# EAGLE board secs_q84 v2 (EAGLE 9.6.2), part 1 of 2
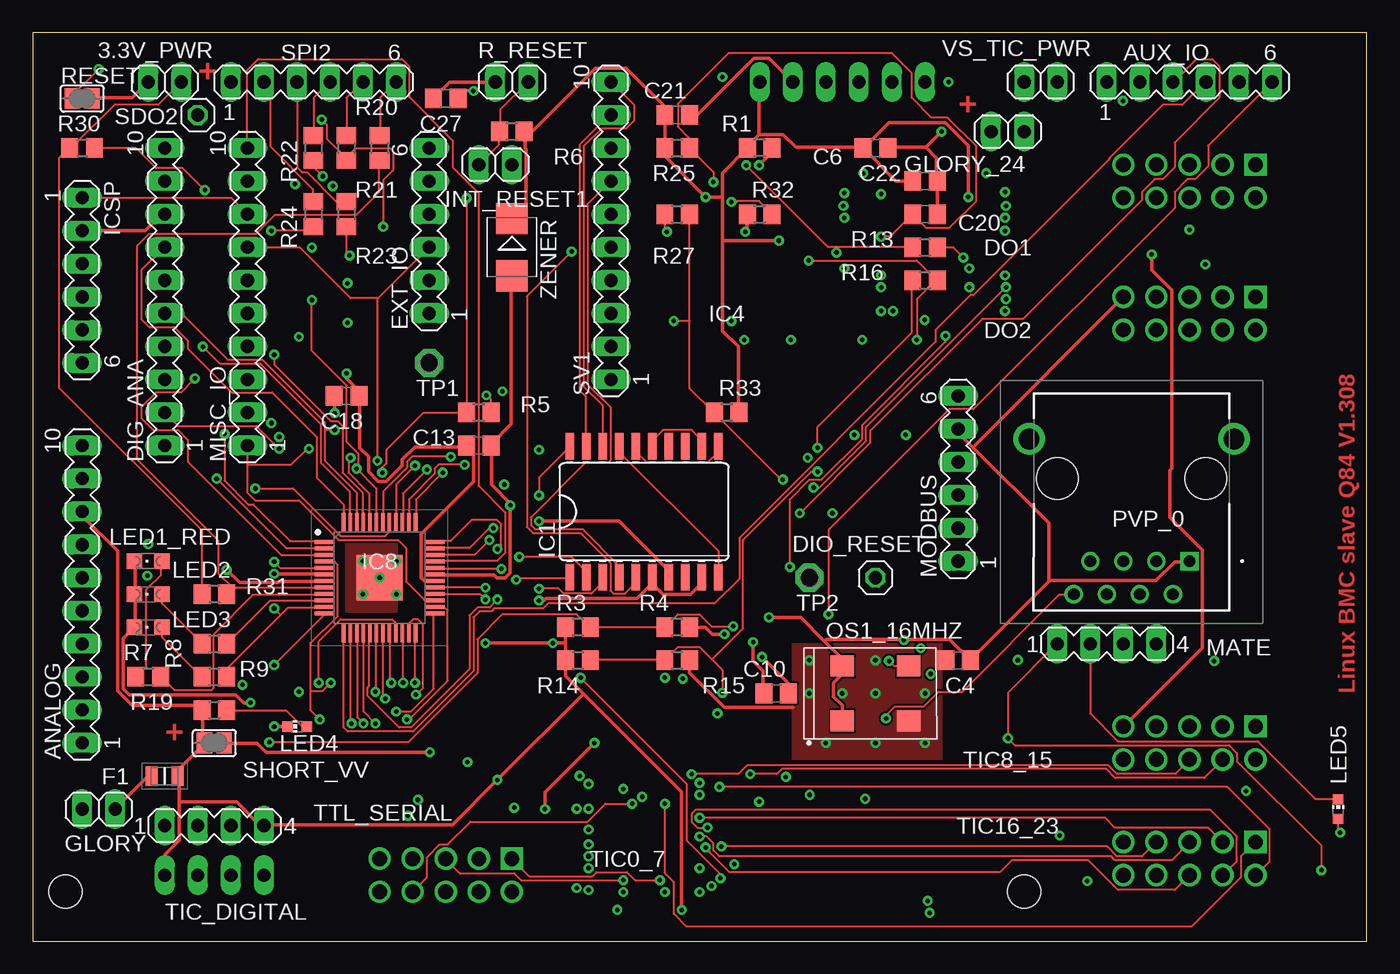
[diagram p2: board, top side]
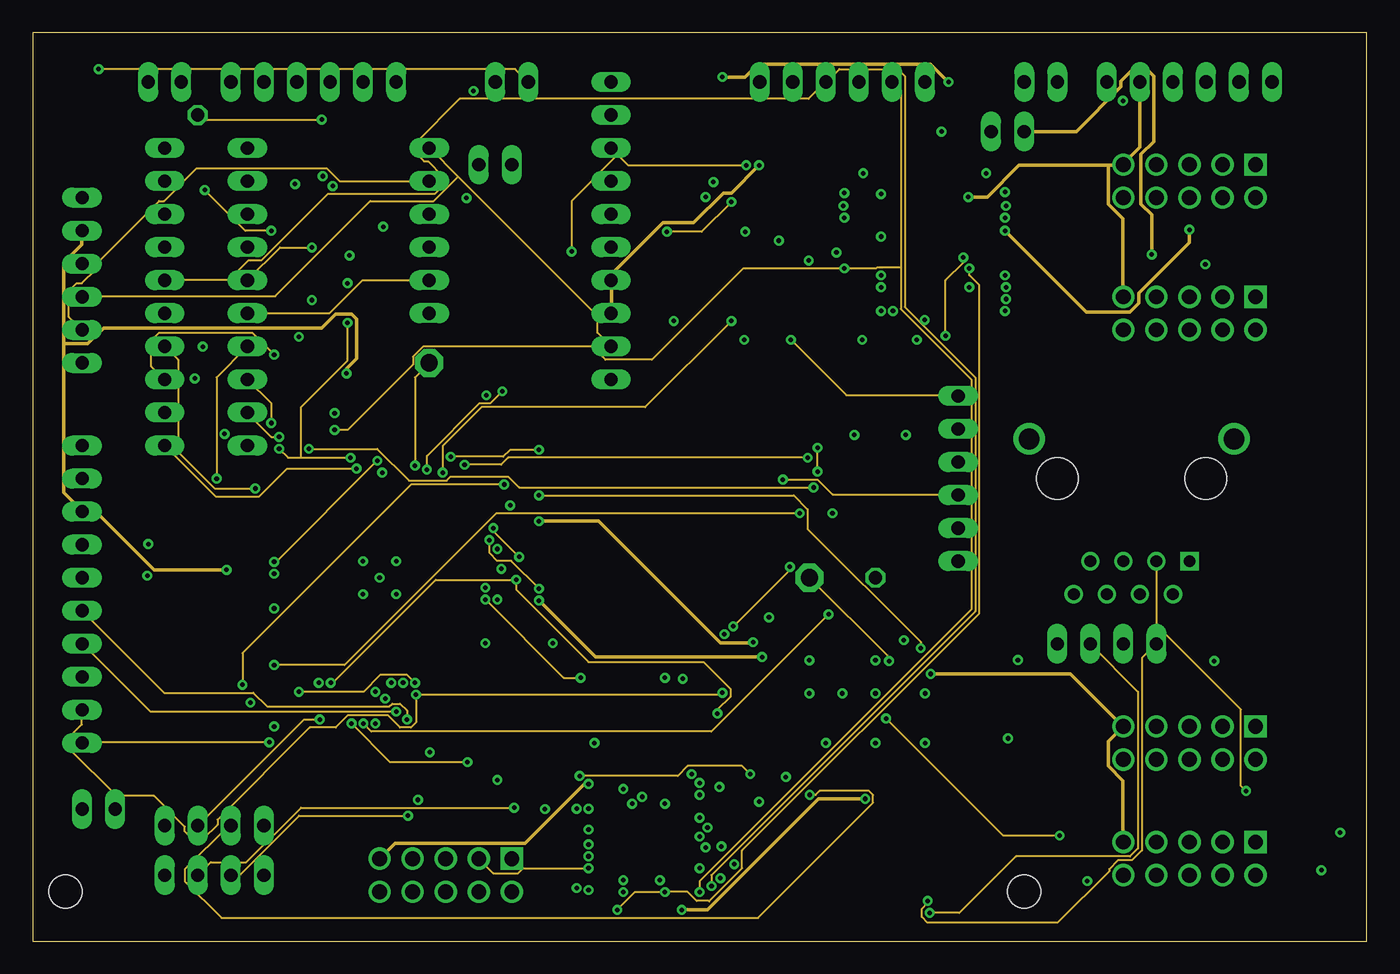
[diagram p3: board, inner layer Route2]
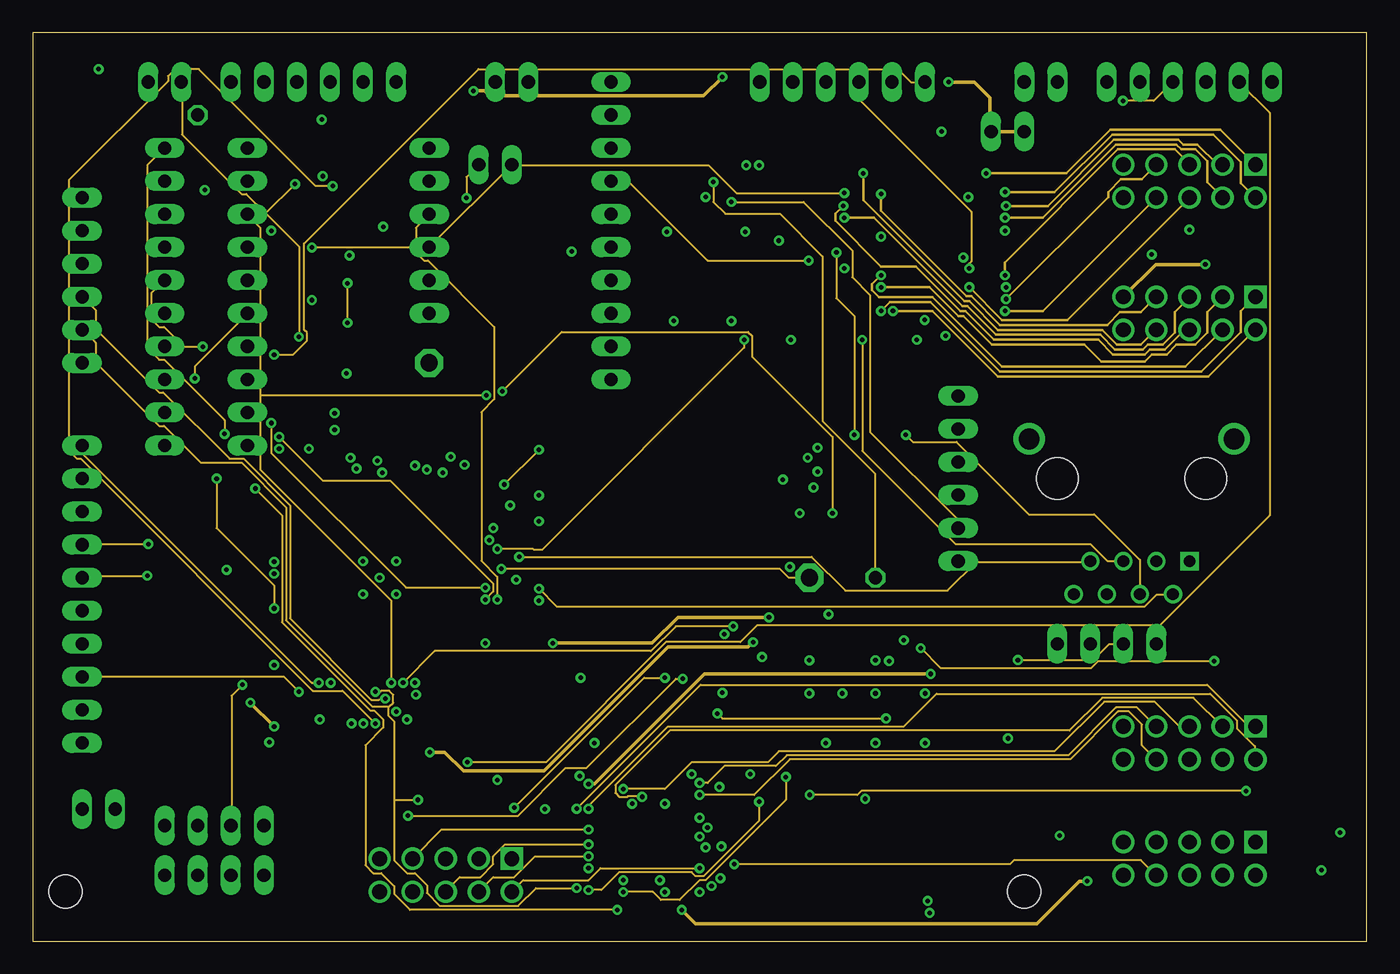
[diagram p4: board, inner layer Route15]
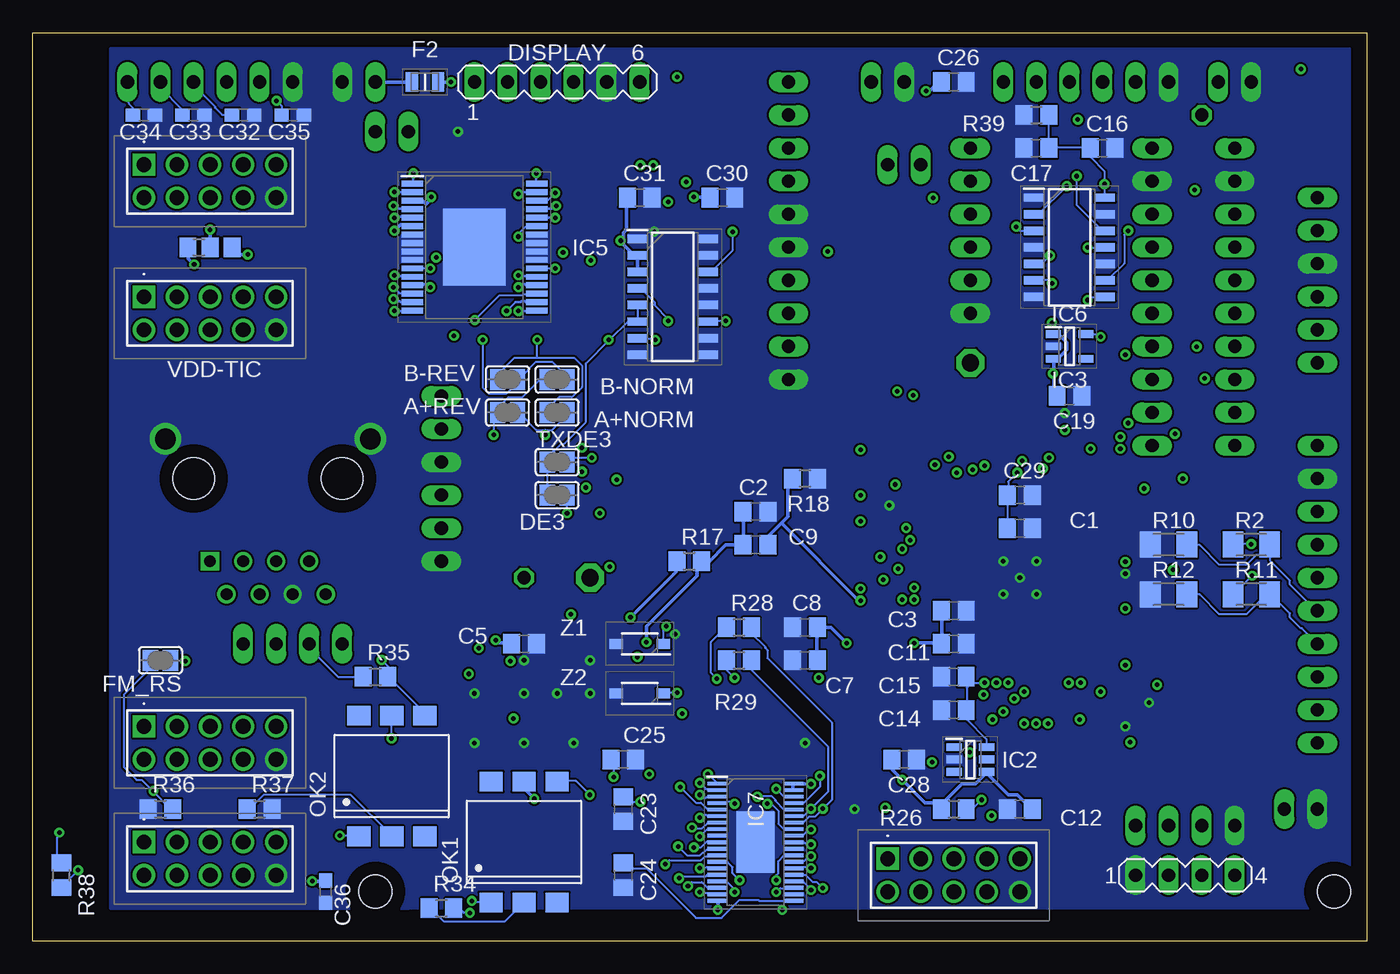
[diagram p5: board, bottom side, seen from below]

Size 102.54 x 69.84 mm. Coordinates in mm from the lower left corner, seen from the top.
Outline: 0,0 102.54,0 102.54,69.84 0,69.84 0,0
Copper layers (1+2*15+16): Top 0.035mm / dielectric 1.5mm / Route2 0.035mm / dielectric 0.15mm / Route15 0.035mm / dielectric 0.2mm / Bottom 0.035mm
Design rules "default *": minimum track width 6mil, minimum drill 0.35mm, track to track 6mil, track to pad 6mil, pad to pad 6mil, via to via 6mil, smd to smd 6mil, copper to edge 40mil, drill to drill 6mil, minimum pad ring 10mil, minimum via ring 8mil, stop-mask expansion 4mil, vias tented up to drill 0mil, thermal gap 10mil
Net classes: 1 icurrent: width 0.254 mm; 2 ocurrent: width 0.203 mm
Holes 2.54 mm at 2.54,3.81 76.2,3.81
vRestrict: area 19.1,20.3 to 34.3,35.6; area 52.1,39.4 to 76.2,45.7; area 39.4,25.4 to 57.1,40.6

## Footprints (pad centres in the part's own frame; a part is rotated, then mirrored left to right if it is on the bottom)
1X02 = drill 1.016 long: 1 -1.27,0; 2 1.27,0
SJ = smd 1.168 x 1.6: 1 -0.762,0; 2 0.762,0
MA10-1 = drill 1.016 long: 1 -11.43,0; 2 -8.89,0; 3 -6.35,0; 4 -3.81,0; 5 -1.27,0; 6 1.27,0; 7 3.81,0; 8 6.35,0; 9 8.89,0; 10 11.43,0
MA06-1 = drill 1.016 long: 1 -6.35,0; 2 -3.81,0; 3 -1.27,0; 4 1.27,0; 5 3.81,0; 6 6.35,0
C0805 = smd 1.3 x 1.5: 1 -0.95,0; 2 0.95,0
C0603 = smd 1.1 x 1: 1 -0.85,0; 2 0.85,0
1X01 = drill 1.016 octagon: 1 0,0
879141016 = drill 1.14 pad 1.71 square: 1 0,0 | drill 1.14 pad 1.71: 2 0,-2.54; 3 2.54,0; 4 2.54,-2.54; 5 5.08,0; 6 5.08,-2.54; 7 7.62,0; 8 7.62,-2.54; 9 10.16,0; 10 10.16,-2.54
FUSC2114X125N = smd 0.93 x 1.52: 1 -1,0; 2 1,0
SO20L = smd 0.66 x 2.032: 1 -5.715,-5.029; 2 -4.445,-5.029; 3 -3.175,-5.029; 4 -1.905,-5.029; 5 -0.635,-5.029; 6 0.635,-5.029; 7 1.905,-5.029; 8 3.175,-5.029; 9 4.445,-5.029; 10 5.715,-5.029; 11 5.715,5.029; 12 4.445,5.029; 13 3.175,5.029; 14 1.905,5.029; 15 0.635,5.029; 16 -0.635,5.029; 17 -1.905,5.029; 18 -3.175,5.029; 19 -4.445,5.029; 20 -5.715,5.029
SOT95P280X145-6N = smd 1.2 x 0.6: 1 -1.25,0.95; 2 -1.25,0; 3 -1.25,-0.95; 4 1.25,-0.95; 5 1.25,0; 6 1.25,0.95
SOT95P280X100-5N = smd 1.15 x 0.6: 1 -1.25,0.95; 2 -1.25,0; 3 -1.25,-0.95; 4 1.25,-0.95; 5 1.25,0.95
SOIC127P600X175-16N = smd 1.525 x 0.65: 1 -2.712,4.445; 2 -2.712,3.175; 3 -2.712,1.905; 4 -2.712,0.635; 5 -2.712,-0.635; 6 -2.712,-1.905; 7 -2.712,-3.175; 8 -2.712,-4.445; 9 2.712,-4.445; 10 2.712,-3.175; 11 2.712,-1.905; 12 2.712,-0.635; 13 2.712,0.635; 14 2.712,1.905; 15 2.712,3.175; 16 2.712,4.445
SOP65P1030X265-33N = smd 1.65 x 0.45: 1 -4.775,4.875; 2 -4.775,4.225; 3 -4.775,3.575; 4 -4.775,2.925; 5 -4.775,2.275; 6 -4.775,1.625; 7 -4.775,0.975; 8 -4.775,0.325; 9 -4.775,-0.325; 10 -4.775,-0.975; 11 -4.775,-1.625; 12 -4.775,-2.275; 13 -4.775,-2.925; 14 -4.775,-3.575; 15 -4.775,-4.225; 16 -4.775,-4.875; 17 4.775,-4.875; 18 4.775,-4.225; 19 4.775,-3.575; 20 4.775,-2.925; 21 4.775,-2.275; 22 4.775,-1.625; 23 4.775,-0.975; 24 4.775,-0.325; 25 4.775,0.325; 26 4.775,0.975; 27 4.775,1.625; 28 4.775,2.275; 29 4.775,2.925; 30 4.775,3.575; 31 4.775,4.225; 32 4.775,4.875 | smd 4.8 x 5.9: 33 0,0
SOIC127P600X175-14N = smd 1.55 x 0.65: 1 -2.725,3.81; 2 -2.725,2.54; 3 -2.725,1.27; 4 -2.725,0; 5 -2.725,-1.27; 6 -2.725,-2.54; 7 -2.725,-3.81; 8 2.725,-3.81; 9 2.725,-2.54; 10 2.725,-1.27; 11 2.725,0; 12 2.725,1.27; 13 2.725,2.54; 14 2.725,3.81
SOP50P640X120-39N = smd 1.475 x 0.3: 1 -2.938,4.5; 2 -2.938,4; 3 -2.938,3.5; 4 -2.938,3; 5 -2.938,2.5; 6 -2.938,2; 7 -2.938,1.5; 8 -2.938,1; 9 -2.938,0.5; 10 -2.938,0; 11 -2.938,-0.5; 12 -2.938,-1; 13 -2.938,-1.5; 14 -2.938,-2; 15 -2.938,-2.5; 16 -2.938,-3; 17 -2.938,-3.5; 18 -2.938,-4; 19 -2.938,-4.5; 20 2.938,-4.5; 21 2.938,-4; 22 2.938,-3.5; 23 2.938,-3; 24 2.938,-2.5; 25 2.938,-2; 26 2.938,-1.5; 27 2.938,-1; 28 2.938,-0.5; 29 2.938,0; 30 2.938,0.5; 31 2.938,1; 32 2.938,1.5; 33 2.938,2; 34 2.938,2.5; 35 2.938,3; 36 2.938,3.5; 37 2.938,4; 38 2.938,4.5 | smd 2.9 x 4.7: 39 0,0
QFP50P900X900X120-49N = smd 1.475 x 0.3: 1 -4.238,2.75; 2 -4.238,2.25; 3 -4.238,1.75; 4 -4.238,1.25; 5 -4.238,0.75; 6 -4.238,0.25; 7 -4.238,-0.25; 8 -4.238,-0.75; 9 -4.238,-1.25; 10 -4.238,-1.75; 11 -4.238,-2.25; 12 -4.238,-2.75; 25 4.238,-2.75; 26 4.238,-2.25; 27 4.238,-1.75; 28 4.238,-1.25; 29 4.238,-0.75; 30 4.238,-0.25; 31 4.238,0.25; 32 4.238,0.75; 33 4.238,1.25; 34 4.238,1.75; 35 4.238,2.25; 36 4.238,2.75 | smd 0.3 x 1.475: 13 -2.75,-4.238; 14 -2.25,-4.238; 15 -1.75,-4.238; 16 -1.25,-4.238; 17 -0.75,-4.238; 18 -0.25,-4.238; 19 0.25,-4.238; 20 0.75,-4.238; 21 1.25,-4.238; 22 1.75,-4.238; 23 2.25,-4.238; 24 2.75,-4.238; 37 2.75,4.238; 38 2.25,4.238; 39 1.75,4.238; 40 1.25,4.238; 41 0.75,4.238; 42 0.25,4.238; 43 -0.25,4.238; 44 -0.75,4.238; 45 -1.25,4.238; 46 -1.75,4.238; 47 -2.25,4.238; 48 -2.75,4.238 | smd 3.5 x 3.5: 49 0,0
CHIPLED_0805 = smd 1.2 x 1.2: A 0,-1.05; C 0,1.05
CHIP-LED0603 = smd 0.8 x 0.8: A 0,-0.75; C 0,0.75
MA04-1 = drill 1.016 long: 1 -3.81,0; 2 -1.27,0; 3 1.27,0; 4 3.81,0
DIL6-SMD = smd 1.78 x 1.52: 1 -2.54,-4.645; 2 0,-4.645; 3 2.54,-4.645; 4 2.54,4.645; 5 0,4.645; 6 -2.54,4.645
7.2X5.2-4-PAD = smd 1.8 x 1.6: 1 -2.54,-2.1; 2 2.54,-2.1; 3 2.54,2.1; 4 -2.54,2.1
317345774 = drill 0.9 pad 1.4 square: 1 0,0 | drill 0.9 pad 1.4: 2 -1.27,-2.54; 3 -2.54,0; 4 -3.81,-2.54; 5 -5.08,0; 6 -6.35,-2.54; 7 -7.62,0; 8 -8.89,-2.54 | drill 1.6 pad 2.4: 9 3.43,9.4; 10 -12.32,9.4 | hole 3.2: 1.27,6.35; -10.16,6.35
R0805 = smd 1.3 x 1.5: 1 -0.95,0; 2 0.95,0
M1206 = smd 1.6 x 2: 1 -1.4,0; 2 1.4,0
P1-13 = drill 1.321 pad 2.159 octagon: TP 0,0
A0R-JMP = smd 1.5 x 1.3: 1 0,1.7; 2 0,0; 3 0,-1.7
SOD3716X135N = smd 1.05 x 0.75: 1 -1.8,0; 2 1.8,0
SMB = smd 2.4 x 2.4: A 2.2,0; C -2.2,0

## Placement (x,y rotation side)
3.3V_PWR  3.3V_PWR  [1X02]  10.16,66.04 0 top
A+NORM  A+NORM  [SJ]  62.23,40.64 0 bottom
A+REV  A+REV  [SJ]  66.04,40.64 0 bottom
ANALOG  Analog  [MA10-1]  3.81,26.67 90 top
AUX_IO  AUX_IO  [MA06-1]  88.9,66.04 0 top
B-NORM  B-NORM  [SJ]  62.23,43.18 0 bottom
B-REV  B-REV  [SJ]  66.04,43.18 0 bottom
C1  0.1uf  [C0805]  26.67,31.75 0 bottom
C2  0.1uf  [C0805]  46.99,33.02 0 bottom
C3  0.1uf  [C0805]  31.75,25.4 0 bottom
C4  10uf  [C0805]  71.12,21.59 180 top
C5  0.1uf  [C0805]  64.77,22.86 0 bottom
C6  10uf  [C0805]  64.77,60.96 0 top
C7  0.1uf  [C0805]  43.18,21.59 180 bottom
C8  10uf  [C0805]  43.18,24.13 180 bottom
C9  0.1uf  [C0805]  46.99,30.48 0 bottom
C10  10uf  [C0805]  57.15,19.05 0 top
C11  0.1uf  [C0805]  31.75,22.86 0 bottom
C12  0.1uf  [C0805]  26.67,10.16 180 bottom
C13  10uf  [C0805]  34.29,38.1 0 top
C14  0.1uf  [C0805]  31.75,17.78 180 bottom
C15  10uf  [C0805]  31.75,20.32 180 bottom
C16  0.1uf  [C0805]  20.32,60.96 0 bottom
C17  10uf  [C0805]  25.4,60.96 180 bottom
C18  10uf  [C0805]  24.13,41.91 180 top
C19  0.1uf  [C0805]  22.86,41.91 0 bottom
C20  0.1uf  [C0805]  68.58,55.88 0 top
C21  0.1uf  [C0805]  49.53,63.5 0 top
C22  10uf  [C0805]  68.58,58.42 0 top
C23  0.1uf  [C0805]  57.15,10.16 270 bottom
C24  0.1uf  [C0805]  57.15,5.08 270 bottom
C25  1uf  [C0805]  57.15,13.97 0 bottom
C26  0.1uf  [C0805]  31.75,66.04 0 bottom
C27  10uf  [C0805]  31.75,64.77 180 top
C28  0.1uf  [C0805]  35.56,13.97 0 bottom
C29  10uf  [C0805]  26.67,34.29 0 bottom
C30  10uf  [C0805]  49.53,57.15 0 bottom
C31  0.1uf  [C0805]  55.88,57.15 0 bottom
C32  0.1uf  [C0603]  86.36,63.5 0 bottom
C33  0.1uf  [C0603]  90.17,63.5 0 bottom
C34  0.1uf  [C0603]  93.98,63.5 0 bottom
C35  0.1uf  [C0603]  82.55,63.5 0 bottom
C36  0.1uf  [C0603]  80.01,3.81 270 bottom
DE3  DE3  [SJ]  62.23,34.29 0 bottom
DIG_ANA  Digtal/Analog  [MA10-1]  10.16,49.53 90 top
DIO_RESET  dio reset  [1X01]  64.77,27.94 0 top
DISPLAY  DISPLAY  [MA06-1]  62.23,66.04 0 bottom
DO1  87914-1016  [879141016]  93.98,59.69 0 bottom
DO2  87914-1016  [879141016]  93.98,49.53 0 bottom
EXT_IO  EXT_IO  [MA06-1]  30.48,54.61 90 top
F1  0805L075WR  [FUSC2114X125N]  10.16,12.7 0 top
F2  0805L075WR  [FUSC2114X125N]  72.39,66.04 0 bottom
FM_RS  FM_RS  [SJ]  92.71,21.59 180 bottom
GLORY  GLORY  [1X02]  5.08,10.16 0 top
GLORY_24  GLORY_24  [1X02]  74.93,62.23 0 top
IC1  MAX203ECWP  [SO20L]  46.99,33.02 0 top
IC2  REF3440TIDBVR  [SOT95P280X145-6N]  30.48,13.97 0 bottom
IC3  ADP151AUJZ-3.3-R7  [SOT95P280X100-5N]  22.86,45.72 0 bottom
IC4  ADM3095EBRZ  [SOIC127P600X175-16N]  53.34,49.53 0 bottom
IC5  MCZ33996EK  [SOP65P1030X265-33N]  68.58,53.34 0 bottom
IC6  74HC125D  [SOIC127P600X175-14N]  22.86,53.34 0 bottom
IC7  TIC12400DCPR  [SOP50P640X120-39N]  46.99,7.62 0 bottom
IC8  PIC18F57Q84-I_PT  [QFP50P900X900X120-49N]  26.67,27.94 0 top
ICSP  ICSP  [MA06-1]  3.81,50.8 270 top
INT_RESET1  int_reset  [1X02]  35.56,59.69 0 top
LED1_RED  L1  [CHIPLED_0805]  8.89,29.21 90 top
LED2  L2  [CHIPLED_0805]  8.89,26.67 90 top
LED3  L3  [CHIPLED_0805]  8.89,24.13 90 top
LED4  POWER  [CHIP-LED0603]  20.32,16.51 90 top
LED5  FM80 POWER  [CHIP-LED0603]  100.33,10.16 0 top
MATE  MATE  [MA04-1]  82.55,22.86 0 top
MISC_IO  misc-io  [MA10-1]  16.51,49.53 90 top
MODBUS  MODBUS  [MA06-1]  71.12,35.56 90 top
OK1  4N25SM  [DIL6-SMD]  64.77,7.62 0 bottom
OK2  4N25SM  [DIL6-SMD]  74.93,12.7 0 bottom
OS1_16MHZ  OSC-OE-CFPS-72  [7.2X5.2-4-PAD]  64.77,19.05 0 top
PVP_0  3-1734577-4  [317345774]  88.9,29.21 0 top
R1  0ohm  [R0805]  55.88,60.96 180 top
R2  11k  [M1206]  8.89,30.48 0 bottom
R3  12.1k  [R0805]  41.91,24.13 180 top
R4  12.1k  [R0805]  49.53,24.13 180 top
R5  56ohm  [R0805]  34.29,40.64 0 top
R6  10k  [R0805]  36.83,62.23 0 top
R7  2.2k  [R0805]  8.89,20.32 0 top
R8  2.2k  [R0805]  13.97,22.86 0 top
R9  2.2k  [R0805]  13.97,20.32 0 top
R10  750 ohm  [M1206]  15.24,30.48 0 bottom
R11  11k  [M1206]  8.89,26.67 0 bottom
R12  750 ohm  [M1206]  15.24,26.67 0 bottom
R13  82.5k  [R0805]  68.58,53.34 0 top
R14  12.1k  [R0805]  41.91,21.59 0 top
R15  12.1k  [R0805]  49.53,21.59 0 top
R16  82.5k  [R0805]  68.58,50.8 0 top
R17  0ohm  [R0805]  52.07,29.21 0 bottom
R18  0ohm  [R0805]  43.18,35.56 180 bottom
R19  2.2k  [R0805]  13.97,17.78 0 top
R20  22 ohm  [R0805]  26.67,60.96 270 top
R21  22 ohm  [R0805]  24.13,60.96 270 top
R22  22 ohm  [R0805]  21.59,60.96 270 top
R23  22 ohm  [R0805]  24.13,55.88 270 top
R24  22 ohm  [R0805]  21.59,55.88 270 top
R25  1k  [R0805]  49.53,60.96 0 top
R26  4.7k  [R0805]  31.75,10.16 0 bottom
R27  120  [R0805]  49.53,55.88 0 top
R28  390 ohm  [R0805]  48.26,24.13 0 bottom
R29  390 ohm  [R0805]  48.26,21.59 0 bottom
R30  10k  [R0805]  3.81,60.96 0 top
R31  4.7k  [R0805]  13.97,26.67 180 top
R32  1.2k  [R0805]  55.88,55.88 0 top
R33  1.2k  [R0805]  53.34,40.64 0 top
R34  2.2k  [R0805]  71.12,2.54 0 bottom
R35  2.2k  [R0805]  76.2,20.32 0 bottom
R36  1k  [R0805]  92.71,10.16 0 bottom
R37  470  [R0805]  85.09,10.16 0 bottom
R38  10k  [R0805]  100.33,5.08 90 bottom
R39  120  [R0805]  25.4,63.5 0 bottom
R_RESET  remote_reset  [1X02]  36.83,66.04 0 top
RESET  reset  [SJ]  3.81,64.77 0 top
SDO2  SDO2  [1X01]  12.7,63.5 0 top
SHORT_VV  short_vv  [SJ]  13.97,15.24 0 top
SPI2  SPI2  [MA06-1]  21.59,66.04 0 top
SV1  SERIAL BUS  [MA10-1]  44.45,54.61 90 top
TIC0_7  87914-1016  [879141016]  36.83,6.35 0 bottom
TIC8_15  87914-1016  [879141016]  93.98,16.51 0 bottom
TIC16_23  87914-1016  [879141016]  93.98,7.62 0 bottom
TIC_DIGITAL  TIC_DIGITAL  [MA04-1]  13.97,5.08 0 bottom
TP1  PTR1PAD1-13  [P1-13]  30.48,44.45 0 top
TP2  PTR1PAD1-13  [P1-13]  59.69,27.94 0 top
TTL_SERIAL  TTL Serial  [MA04-1]  13.97,8.89 0 top
TXDE3  TXDE3  [SJ]  62.23,36.83 0 bottom
VDD-TIC  0R-JUMPA  [A0R-JMP]  88.9,53.34 90 bottom
VS_TIC_PWR  VS_TIC_PWR  [1X02]  77.47,66.04 180 top
Z1  BZT52B5V6-TP  [SOD3716X135N]  55.88,22.86 180 bottom
Z2  BZT52B5V6-TP  [SOD3716X135N]  55.88,19.05 180 bottom
ZENER  5.6V  [SMB]  36.83,53.34 270 top